# Altium schematic sheet PG06_Nuerosky.SchDoc
size B
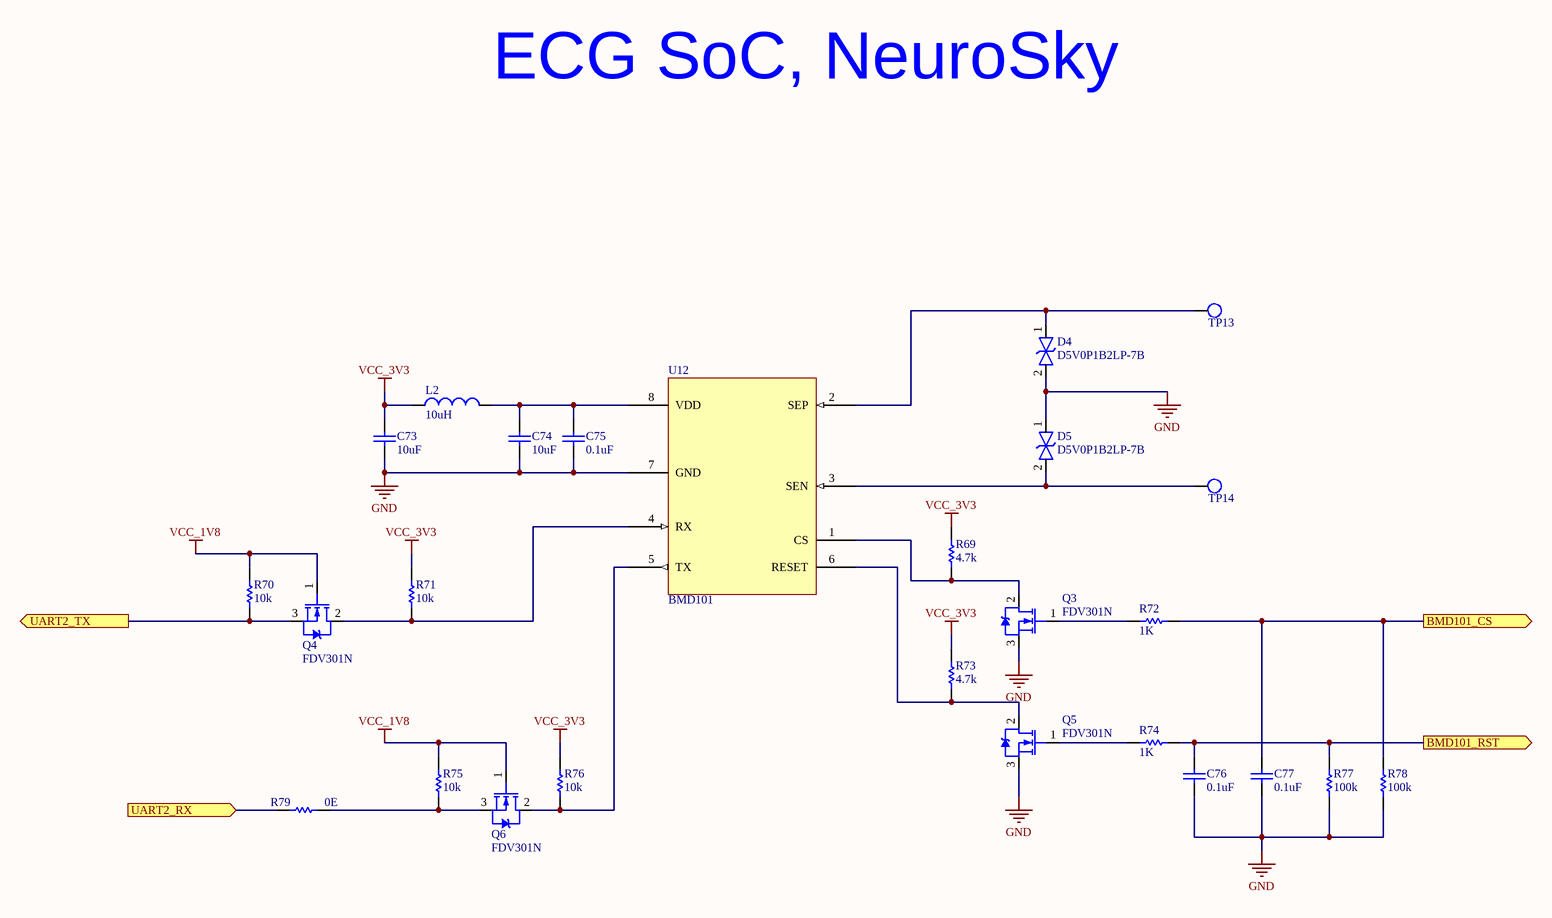
[diagram p0: PG06_Nuerosky.SchDoc]

## Parts
C73  10uF  [0805C]
C74  10uF  [0805C]
C75  0.1uF  [0402C]
C76  0.1uF  [0402C]
C77  0.1uF  [0402C]
D4  D5V0P1B2LP-7B  [D5V0P1B2LP-7B]
D5  D5V0P1B2LP-7B  [D5V0P1B2LP-7B]
L2  10uH  [NR6028T3R0N]
Q3  FDV301N  [SOT_23]
Q4  FDV301N  [SOT_23]
Q5  FDV301N  [SOT_23]
Q6  FDV301N  [SOT_23]
R69  4.7k  [0402R]
R70  10k  [0402R]
R71  10k  [0402R]
R72  1K  [0402R]
R73  4.7k  [0402R]
R74  1K  [0402R]
R75  10k  [0402R]
R76  10k  [0402R]
R77  100k  [0402R]
R78  100k  [0402R]
R79  0E  [0402R]
TP13  Test_Point  [TP_SMD]  (value not drawn)
TP14  Test_Point  [TP_SMD]  (value not drawn)
U12  BMD101  [BMD101]

## Ports
BMD101_CS (out), BMD101_RST (out), UART2_RX (in), UART2_TX (out)

## Nets
GND: C73.1 C74.1 C75.1 C76.1 C77.1 D4.2 D5.1 Q3.3(S) Q5.3(S) R77.1 R78.1 U12.7(GND)
VCC_1V8: Q4.1(G) Q6.1(G) R70.2 R75.2
VCC_3V3: C73.2 L2.1 R69.2 R71.2 R73.2 R76.2
BMD101_CS: C77.2 R72.2 R78.2 ; port BMD101_CS
BMD101_RST: C76.2 R74.2 R77.2 ; port BMD101_RST
UART2_RX: R79.1 ; port UART2_RX
UART2_TX: Q4.3(S) R70.1 ; port UART2_TX
NetC74_2: C74.2 C75.2 L2.2 U12.8(VDD)
NetD4_1: D4.1 TP13.1 U12.2(SEP)
NetD5_2: D5.2 TP14.1 U12.3(SEN)
NetQ3_1: Q3.1(G) R72.1
NetQ3_2: Q3.2(D) R69.1 U12.1(CS)
NetQ4_2: Q4.2(D) R71.1 U12.4(RX)
NetQ5_1: Q5.1(G) R74.1
NetQ5_2: Q5.2(D) R73.1 U12.6(RESET)
NetQ6_2: Q6.2(D) R76.1 U12.5(TX)
NetQ6_3: Q6.3(S) R75.1 R79.2

## Notes on the sheet
- ECG SoC, NeuroSky

## Library data of the parts
C73 C74 = CAP_0805_10uF_16V: CAP CER 10UF 16V X7R 0805; Alternate MFR: Taiyo Yuden; Alternate MPN: EMK212BB7106MG-T; Package: 0805; Value: 10uF
C75-C77 = CAP_0402_0.1uF_50V: CAP CER 0.1UF 50V X7R 0402; Alternate MFR: Samsung Electro-Mechanics; Alternate MPN: CL05B104KB54PNC; Package: 0402; Value: 0.1uF
D4 D5 = TVS_D5V0P1B2LP-7B: TVS DIODE 5.5VWM 13VC DFN1006-2; MFR: Diodes Incorporated; MPN: D5V0P1B2LP-7B; Package: X1-DFN1006-2
L2 = IND_10uH: WE-PMI POWER MULTILAYER INDUCTOR; MFR: Würth Elektronik; MPN: 74479777310A; Package: 0805; Alternate MFR: *; Alternate MPN: *; Value: 10uH
Q3-Q6 = NMOS_FDV301N: MOSFET N-CH 25V 220MA SOT23; MFR: onsemi; ComponentLink1Description: Manufacturer Link; ComponentLink1URL: http://www.irf.com/; MPN: FDV301N; Package: SOT23
R69 R73 = RES_0402_4.7k: RES 4.7K OHM 1% 1/16W 0402; MFR: Generic; Alternate MFR: YAGEO; Alternate MPN: RC0402FR-134K7L; MPN: Generic; Package: 0402; Value: 4.7k
R70 R71 R75 R76 = RES_0402_10k: RES SMD 10K OHM 1% 1/16W 0402; MFR: Generic; Alternate MFR: YAGEO; Alternate MPN: AF0402FR-0710KL; MPN: Generic; Package: 0402; Value: 10k
R72 R74 = RES_0402_1k: RES SMD 1K OHM 1% 1/16W 0402; MFR: Generic; Alternate MFR: YAGEO; Alternate MPN: AC0402FR-071KL; MPN: Generic; Package: 0402; Value: 1K
R77 R78 = RES_0402_100k: RES 100K OHM 1% 1/16W 0402; MFR: Generic; Alternate MFR: YAGEO; Alternate MPN: RC0402FR-07100KP; MPN: Generic; Package: 0402; Value: 100k
R79 = RES_0402_0E: RES 0 OHM JUMPER 1/16W 0402; MFR: Generic; Alternate MFR: YAGEO; Alternate MPN: AC0402JR-130RL; MPN: Generic; Package: 0402; Value: 0E
TP13 TP14 = Test_Point_1
U12 = Bio-Signal_SoC_BMD101: Mixed Signal SoC with Integrated AFE, DSP functions and UART; MFR: NeuroSky; MPN: BMD101